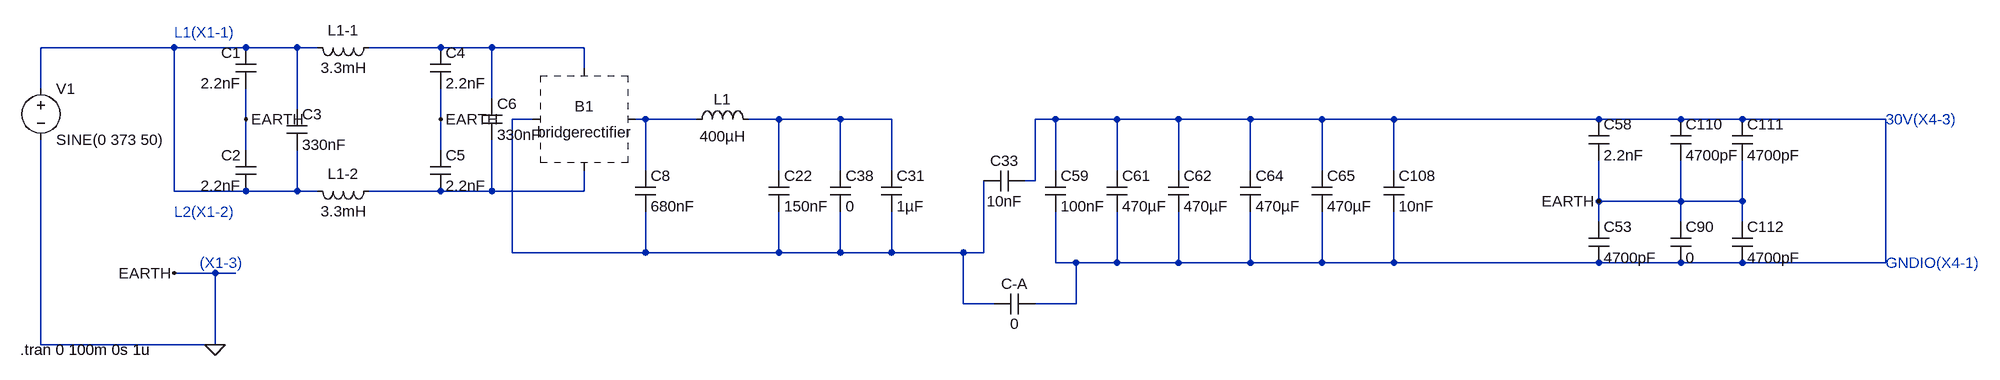
[diagram p0: schematic 90W-Leakeage-Model.asc]
90W-Leakeage-Model.asc, the LTspice schematic file:
Version 4
SHEET 1 2772 680
WIRE -64 -128 -272 -128
WIRE 48 -128 -64 -128
WIRE 128 -128 48 -128
WIRE 160 -128 128 -128
WIRE 352 -128 240 -128
WIRE 432 -128 352 -128
WIRE 576 -128 432 -128
WIRE 576 -96 576 -128
WIRE -272 -64 -272 -128
WIRE 432 -48 432 -128
WIRE 128 -32 128 -128
WIRE 48 -16 48 -64
WIRE 352 -16 352 -64
WIRE 496 -16 464 -16
WIRE 672 -16 656 -16
WIRE 752 -16 672 -16
WIRE 880 -16 832 -16
WIRE 976 -16 880 -16
WIRE 1056 -16 976 -16
WIRE 1312 -16 1280 -16
WIRE 1408 -16 1312 -16
WIRE 1504 -16 1408 -16
WIRE 1616 -16 1504 -16
WIRE 1728 -16 1616 -16
WIRE 1840 -16 1728 -16
WIRE 2160 -16 1840 -16
WIRE 2288 -16 2160 -16
WIRE 2384 -16 2288 -16
WIRE 2608 -16 2384 -16
WIRE 48 32 48 -16
WIRE 352 32 352 -16
WIRE 672 64 672 -16
WIRE 880 64 880 -16
WIRE 976 64 976 -16
WIRE 1056 64 1056 -16
WIRE 1312 64 1312 -16
WIRE 1408 64 1408 -16
WIRE 1504 64 1504 -16
WIRE 1616 64 1616 -16
WIRE 1728 64 1728 -16
WIRE 1840 64 1840 -16
WIRE 1280 80 1280 -16
WIRE 1280 80 1264 80
WIRE -64 96 -64 -128
WIRE 48 96 -64 96
WIRE 128 96 128 32
WIRE 128 96 48 96
WIRE 160 96 128 96
WIRE 352 96 240 96
WIRE 432 96 432 16
WIRE 432 96 352 96
WIRE 576 96 576 64
WIRE 576 96 432 96
WIRE 2160 112 2160 48
WIRE 2288 112 2288 48
WIRE 2288 112 2160 112
WIRE 2384 112 2384 48
WIRE 2384 112 2288 112
WIRE 2160 144 2160 112
WIRE 2288 144 2288 112
WIRE 2384 144 2384 112
WIRE 464 192 464 -16
WIRE 672 192 672 128
WIRE 672 192 464 192
WIRE 880 192 880 128
WIRE 880 192 672 192
WIRE 976 192 976 128
WIRE 976 192 880 192
WIRE 1056 192 1056 128
WIRE 1056 192 976 192
WIRE 1168 192 1056 192
WIRE 1200 192 1200 80
WIRE 1200 192 1168 192
WIRE 1312 208 1312 128
WIRE 1344 208 1312 208
WIRE 1408 208 1408 128
WIRE 1408 208 1344 208
WIRE 1504 208 1504 128
WIRE 1504 208 1408 208
WIRE 1616 208 1616 128
WIRE 1616 208 1504 208
WIRE 1728 208 1728 128
WIRE 1728 208 1616 208
WIRE 1840 208 1840 128
WIRE 1840 208 1728 208
WIRE 2160 208 1840 208
WIRE 2288 208 2160 208
WIRE 2384 208 2288 208
WIRE 2608 208 2608 -16
WIRE 2608 208 2384 208
WIRE 0 224 -64 224
WIRE 32 224 0 224
WIRE 1168 272 1168 192
WIRE 1216 272 1168 272
WIRE 1344 272 1344 208
WIRE 1344 272 1280 272
WIRE -272 336 -272 16
WIRE 0 336 0 224
WIRE 0 336 -272 336
FLAG 48 -16 EARTH
FLAG 352 -16 EARTH
FLAG 2160 112 EARTH
FLAG -64 224 EARTH
FLAG 0 336 0
SYMBOL cap 112 -32 R0
SYMATTR InstName C3
SYMATTR Value 330nF
SYMBOL cap 64 -64 R180
WINDOW 0 24 56 Left 2
WINDOW 3 24 8 Left 2
SYMATTR InstName C1
SYMATTR Value 2.2nF
SYMBOL cap 64 96 R180
WINDOW 0 24 56 Left 2
WINDOW 3 24 8 Left 2
SYMATTR InstName C2
SYMATTR Value 2.2nF
SYMBOL cap 416 -48 R0
SYMATTR InstName C6
SYMATTR Value 330nF
SYMBOL cap 336 -128 R0
SYMATTR InstName C4
SYMATTR Value 2.2nF
SYMBOL cap 336 32 R0
SYMATTR InstName C5
SYMATTR Value 2.2nF
SYMBOL cap 864 64 R0
SYMATTR InstName C22
SYMATTR Value 150nF
SYMBOL cap 960 64 R0
SYMATTR InstName C38
SYMATTR Value 0
SYMBOL cap 1040 64 R0
SYMATTR InstName C31
SYMATTR Value 1µF
SYMBOL cap 656 64 R0
SYMATTR InstName C8
SYMATTR Value 680nF
SYMBOL cap 1392 64 R0
SYMATTR InstName C61
SYMATTR Value 470µF
SYMBOL ind 256 -144 R90
WINDOW 0 5 56 VBottom 2
WINDOW 3 32 56 VTop 2
SYMATTR InstName L1-1
SYMATTR Value 3.3mH
SYMBOL ind 256 80 R90
WINDOW 0 5 56 VBottom 2
WINDOW 3 32 56 VTop 2
SYMATTR InstName L1-2
SYMATTR Value 3.3mH
SYMBOL ZZZ\\bridgerectifier\\bridgerectifier 576 -16 R0
SYMATTR InstName B1
SYMBOL cap 1264 64 R90
WINDOW 0 0 32 VBottom 2
WINDOW 3 32 32 VTop 2
SYMATTR InstName C33
SYMATTR Value 10nF
SYMBOL cap 1296 64 R0
SYMATTR InstName C59
SYMATTR Value 100nF
SYMBOL cap 1488 64 R0
SYMATTR InstName C62
SYMATTR Value 470µF
SYMBOL cap 1600 64 R0
SYMATTR InstName C64
SYMATTR Value 470µF
SYMBOL cap 2144 -16 R0
SYMATTR InstName C58
SYMATTR Value 2.2nF
SYMBOL cap 2272 -16 R0
SYMATTR InstName C110
SYMATTR Value 4700pF
SYMBOL cap 2144 144 R0
SYMATTR InstName C53
SYMATTR Value 4700pF
SYMBOL cap 2272 144 R0
SYMATTR InstName C90
SYMATTR Value 0
SYMBOL voltage -272 -80 R0
WINDOW 123 0 0 Left 0
WINDOW 39 0 0 Left 0
SYMATTR InstName V1
SYMATTR Value SINE(0 373 50)
SYMBOL cap 1280 256 R90
WINDOW 0 0 32 VBottom 2
WINDOW 3 32 32 VTop 2
SYMATTR InstName C-A
SYMATTR Value 0
SYMBOL ind 736 0 R270
WINDOW 0 32 56 VTop 2
WINDOW 3 5 56 VBottom 2
SYMATTR InstName L1
SYMATTR Value 400µH
SYMBOL cap 2368 144 R0
SYMATTR InstName C112
SYMATTR Value 4700pF
SYMBOL cap 1712 64 R0
SYMATTR InstName C65
SYMATTR Value 470µF
SYMBOL cap 1824 64 R0
SYMATTR InstName C108
SYMATTR Value 10nF
SYMBOL cap 2368 -16 R0
SYMATTR InstName C111
SYMATTR Value 4700pF
TEXT -64 -152 Left 2 ;L1(X1-1)
TEXT -64 128 Left 2 ;L2(X1-2)
TEXT -24 208 Left 2 ;(X1-3)
TEXT 2608 -16 Left 2 ;30V(X4-3)
TEXT 2608 208 Left 2 ;GNDIO(X4-1)
TEXT -304 344 Left 2 !.tran 0 100m 0s 1u

The netlist it stands for:
* 90W-Leakeage-Model.asc
C3 N001 N001 330nF
C1 0 N001 2.2nF
C2 N001 0 2.2nF
C6 N002 N007 330nF
C4 N002 0 2.2nF
C5 0 N007 2.2nF
C22 N005 N003 150nF
C38 N005 N003 0
C31 N005 N003 1µF
C8 N004 N003 680nF
C61 N006 N006 470µF
L1-1 N002 N001 3.3mH
L1-2 N007 N001 3.3mH
* B1: bridgerectifier (symbol ZZZ\bridgerectifier\bridgerectifier not available, pin order unknown); nets seen at it: N002, N003, N004, N007
C33 N006 N003 10nF
C59 N006 N006 100nF
C62 N006 N006 470µF
C64 N006 N006 470µF
C58 N006 0 2.2nF
C110 N006 0 4700pF
C53 0 N006 4700pF
C90 0 N006 0
V1 N001 0 SINE(0 373 50)
C-A N006 N003 0
L1 N004 N005 400µH
C112 0 N006 4700pF
C65 N006 N006 470µF
C108 N006 N006 10nF
C111 N006 0 4700pF
* L1(X1-1)
* L2(X1-2)
* (X1-3)
* 30V(X4-3)
* GNDIO(X4-1)
.tran 0 100m 0s 1u
.backanno
.end